# Altium schematic sheet Shot-Clock-Remote.SchDoc
size A4; SheetNumber: 1; SheetTotal: 1
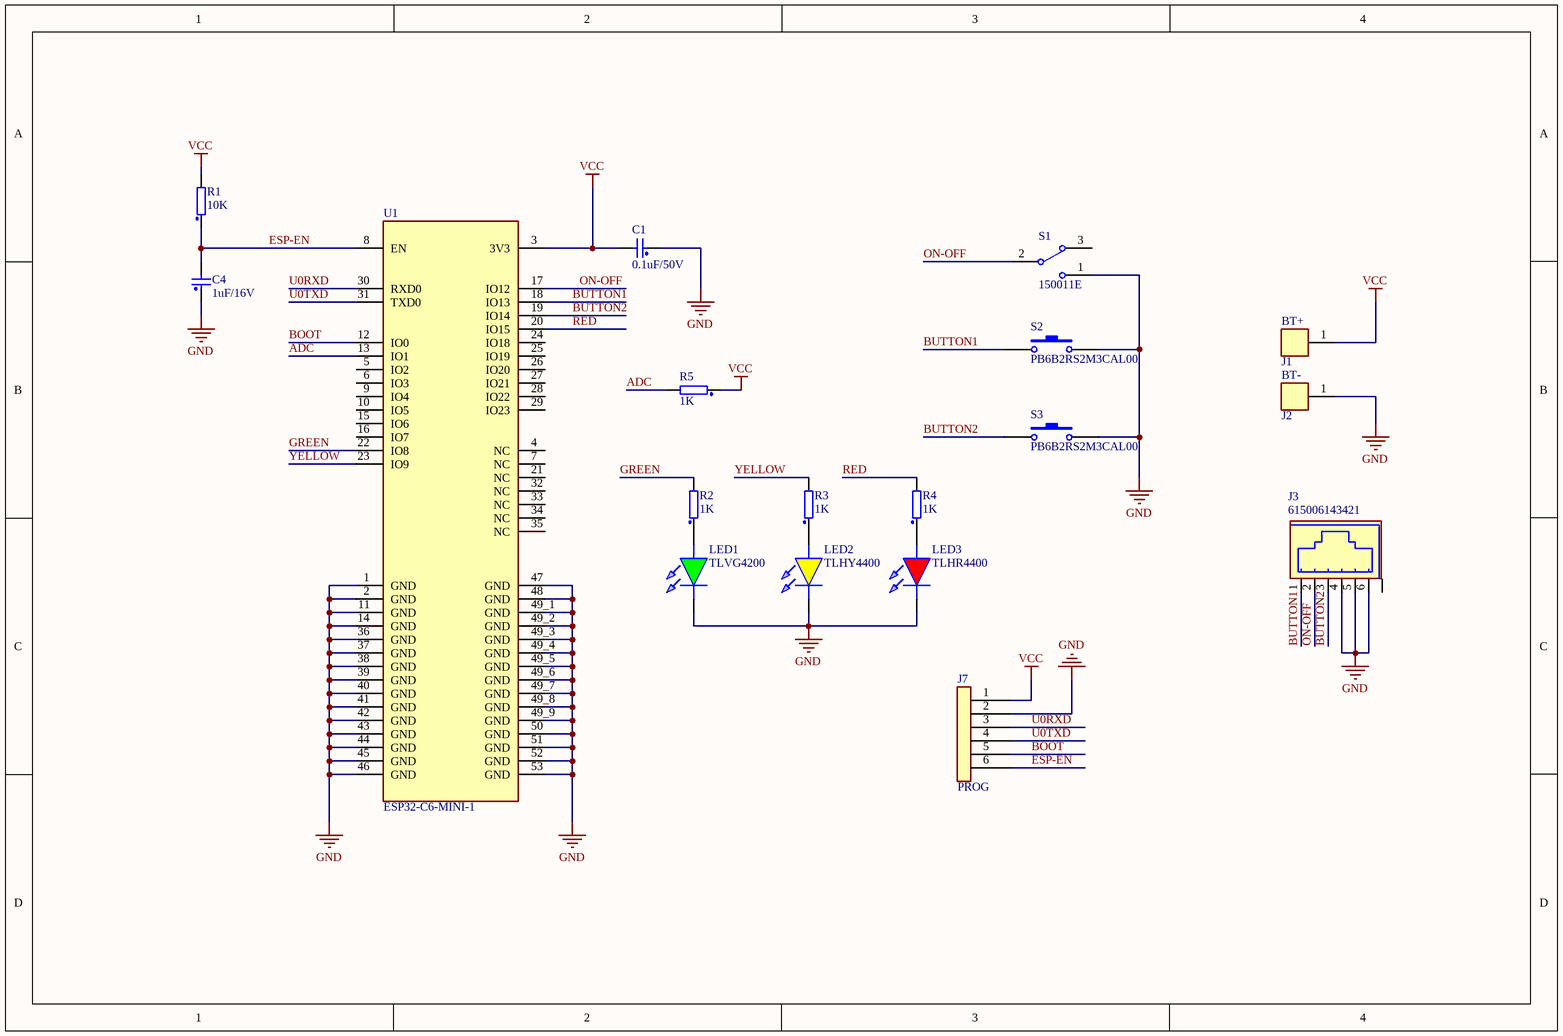
[diagram p0: Shot-Clock-Remote.SchDoc]

## Parts
C1  0.1uF/50V  [CAP-0603]
C4  1uF/16V  [CAP-0603]
J1  BT+  [BT_PAD]
J2  BT-  [BT_PAD]
J3  615006143421  [615006143421]
J7  PROG  [HEADER1X6]
LED1  TLVG4200  [LED3MM_GREEN]
LED2  TLHY4400  [LED3MM_YELLOW]
LED3  TLHR4400  [LED3MM_RED]
R1  10K  [RES-0603]
R2  1K  [RES-0603]
R3  1K  [RES-0603]
R4  1K  [RES-0603]
R5  1K  [RES-0603]
S1  150011E  [150011E]
S2  PB6B2RS2M3CAL00  [PB6B2RS2M3CAL00]
S3  PB6B2RS2M3CAL00  [PB6B2RS2M3CAL00]
U1  ESP32-C6-MINI-1  [XCVR_ESP32-C6-MINI-1]

## Nets
GND: C1.1 C4.1 J2.1 J3.4 J3.5 J3.6 J7.2 LED1.K LED2.K LED3.K S1.1 S2.2 S3.2 U1.1(GND) U1.2(GND) U1.11(GND) U1.14(GND) U1.36(GND) U1.37(GND) U1.38(GND) U1.39(GND) U1.40(GND) U1.41(GND) U1.42(GND) U1.43(GND) U1.44(GND) U1.45(GND) U1.46(GND) U1.47(GND) U1.48(GND) U1.49_1(GND) U1.49_2(GND) U1.49_3(GND) U1.49_4(GND) U1.49_5(GND) U1.49_6(GND) U1.49_7(GND) U1.49_8(GND) U1.49_9(GND) U1.50(GND) U1.51(GND) U1.52(GND) U1.53(GND)
VCC: C1.2 J1.1 J7.1 R1.2 R5.1 U1.3(3V3)
ADC: R5.2 U1.13(IO1)
BOOT: J7.5 U1.12(IO0)
BUTTON1: J3.1 S2.1 U1.18(IO13)
BUTTON2: J3.3 S3.1 U1.19(IO14)
ESP-EN: C4.2 J7.6 R1.1 U1.8(EN)
GREEN: R2.2 U1.22(IO8)
ON-OFF: J3.2 S1.2 U1.17(IO12)
RED: R4.2 U1.20(IO15)
U0RXD: J7.3 U1.30(RXD0)
U0TXD: J7.4 U1.31(TXD0)
YELLOW: R3.2 U1.23(IO9)
NetJ3_S1: J3.S1(SHIELD) J3.S2(SHIELD)
NetLED1_A: LED1.A R2.1
NetLED2_A: LED2.A R3.1
NetLED3_A: LED3.A R4.1

Not connected (* = marked no-connect by the designer): S1 3; U1 4(NC) 5(IO2) 6(IO3) 7(NC) 9(IO4) 10(IO5) 15(IO6) 16(IO7) 21(NC) 24(IO18) 25(IO19) 26(IO20) 27(IO21) 28(IO22) 29(IO23) 32(NC) 33(NC) 34(NC) 35(NC)

## Library data of the parts
C1 = CAP: Multilayer Ceramic Capacitors MLCC - SMD/SMT 50V 100nF X7R 0603 10%; Manufacturer: YAGEO; Manufacturer Part Number: CS0603KRX7R9BB104; Value: 50V/0.1uF; Supplier Part Number: 311-3568-2-ND; Supplier: Digi-key; Price: 0.14
C4 = CAP: 1 µF ±10% 25V Ceramic Capacitor X5R 0603 (1608 Metric); Manufacturer: YAGEO; Manufacturer Part Number: CC0603KRX7R7BB105; Value: 16V/1uF; Supplier Part Number: 311-1446-2-ND; Supplier: Digi-key; Price: 0.14
J1 J2 = BK-82: NO FIT
J3 = 615006143421: Modular Connectors / Ethernet Connectors WR-COM Modular Jack Horztl 1.5A; Manufacturer: Wurth Elektronik; Supplier Part Number: 732-615006143421-ND; Supplier: Digi-key; Value: 615006143421; Manufacturer Part Number: 615006143421; Price: 2.7
J7 = HEADER6_1: Connector Header Through Hole 6 position 0.100" (2.54mm); Manufacturer: Würth Elektronik; Manufacturer Part Number: 61300611121; Value: 61300611121; Supplier Part Number: 732-5319-ND; Supplier: Digi-key; Price: 0.35
LED1 = LED GREEN DIP 3mm: Green 569nm LED Indication - Discrete 2.4V Radial; Manufacturer: Vishay Semiconductor Opto Division; Supplier Part Number: TLVG4200-ND; Supplier: Digi-key; Manufacturer Part Number: TLVG4200; Price: 0.47; Value: TLVG4200
LED2 = LED YELLOW DIP 3mm: Yellow 588nm LED Indication - Discrete 2.4V Radial; Manufacturer: Vishay Semiconductor Opto Division; Supplier Part Number: TLHY4400-ND; Supplier: Digi-key; Manufacturer Part Number: TLHY4400; Price: 0.51; Value: TLHY4400
LED3 = LED RED DIP 3mm: Red 619nm LED Indication - Discrete 2V Radial; Manufacturer: Vishay Semiconductor Opto Division; Supplier Part Number: 751-1127-ND; Supplier: Digi-key; Manufacturer Part Number: TLHR4400; Value: TLHR4400; Price: 0.51
R1 = RES: 10 kOhms ±1% 0.1W, 1/10W Chip Resistor 0603 (1608 Metric) Moisture Resistant Thick Film; Manufacturer Part Number: RC0603FR-0710KL; Manufacturer: YAGEO; Value: 10K; Supplier Part Number: 311-10.0KHRTR-ND; Supplier: Digi-key; Price: 0.1
R2-R5 = RES1: 1 KOhms ±1% 0.1W, 1/10W Chip Resistor 0603 (1608 Metric) Moisture Resistant Thick Film; Manufacturer Part Number: RC0603FR-071KL; Manufacturer: YAGEO; Value: 10K; Supplier Part Number: 311-1.00KHRTR-ND; Supplier: Digi-key; Price: 0.1
S1 = SW-SPDT: SPDT Subminiature Toggle Switch, Right Angle Mounting, Vertical Actuation; Manufacturer: EATON; Supplier Part Number: 87F2624; Supplier: Newark; Manufacturer Part Number: 150011E; Price: 3; Value: 150011E; ComponentLink1Description: Manufacturer Link; ComponentLink1URL: http://www.apem.com
S2 S3 = SW-PB: Pushbutton Switch SPST-NO Standard Panel Mount, Front; Manufacturer: TE Connectivity ALCOSWITCH Switches; Supplier Part Number: 450-2696-ND; Supplier: Digi-key; Manufacturer Part Number: PB6B2RS2M3CAL00; Price: 7; Value: PB6B2RS2M3CAL00
U1 = ESP32-C6-MINI-1: Bluetooth, WiFi 802.11b/g/n, Bluetooth v5.0 Transceiver Module 2.412GHz ~ 2.484GHz PCB Trace Surface Mount; Manufacturer Part Number: ESP32-C3-MINI-1-N4; Manufacturer: Espressif Systems; Value: ESP32-C3-MINI-1-N4; Supplier Part Number: 1965-ESP32-C6-MINI-1-N4TR-ND; Price: 2.5; Supplier: Digi-key